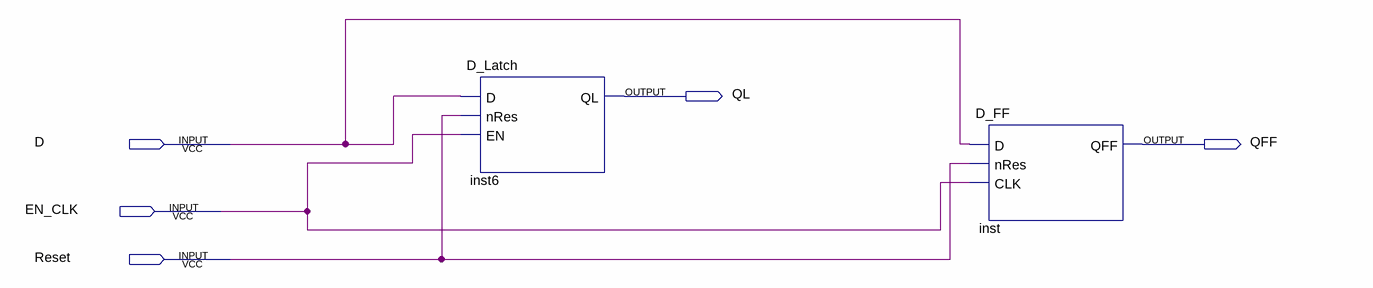
[diagram p0: schematic sheet]
// Quartus schematic DLatchVSDFF.bdf as structural Verilog: 2 symbols, 5 pins
module DLatchVSDFF (
  input  D,
  input  EN_CLK,
  input  Reset,
  output QL,
  output QFF
);

  D_Latch inst6 (.D(D), .nRes(Reset), .EN(EN_CLK), .QL(QL));
  D_FF inst (.D(D), .nRes(Reset), .CLK(EN_CLK), .QFF(QFF));
endmodule
